# Altium schematic sheet Sheet_1.schdoc
size 432 x 289 mm
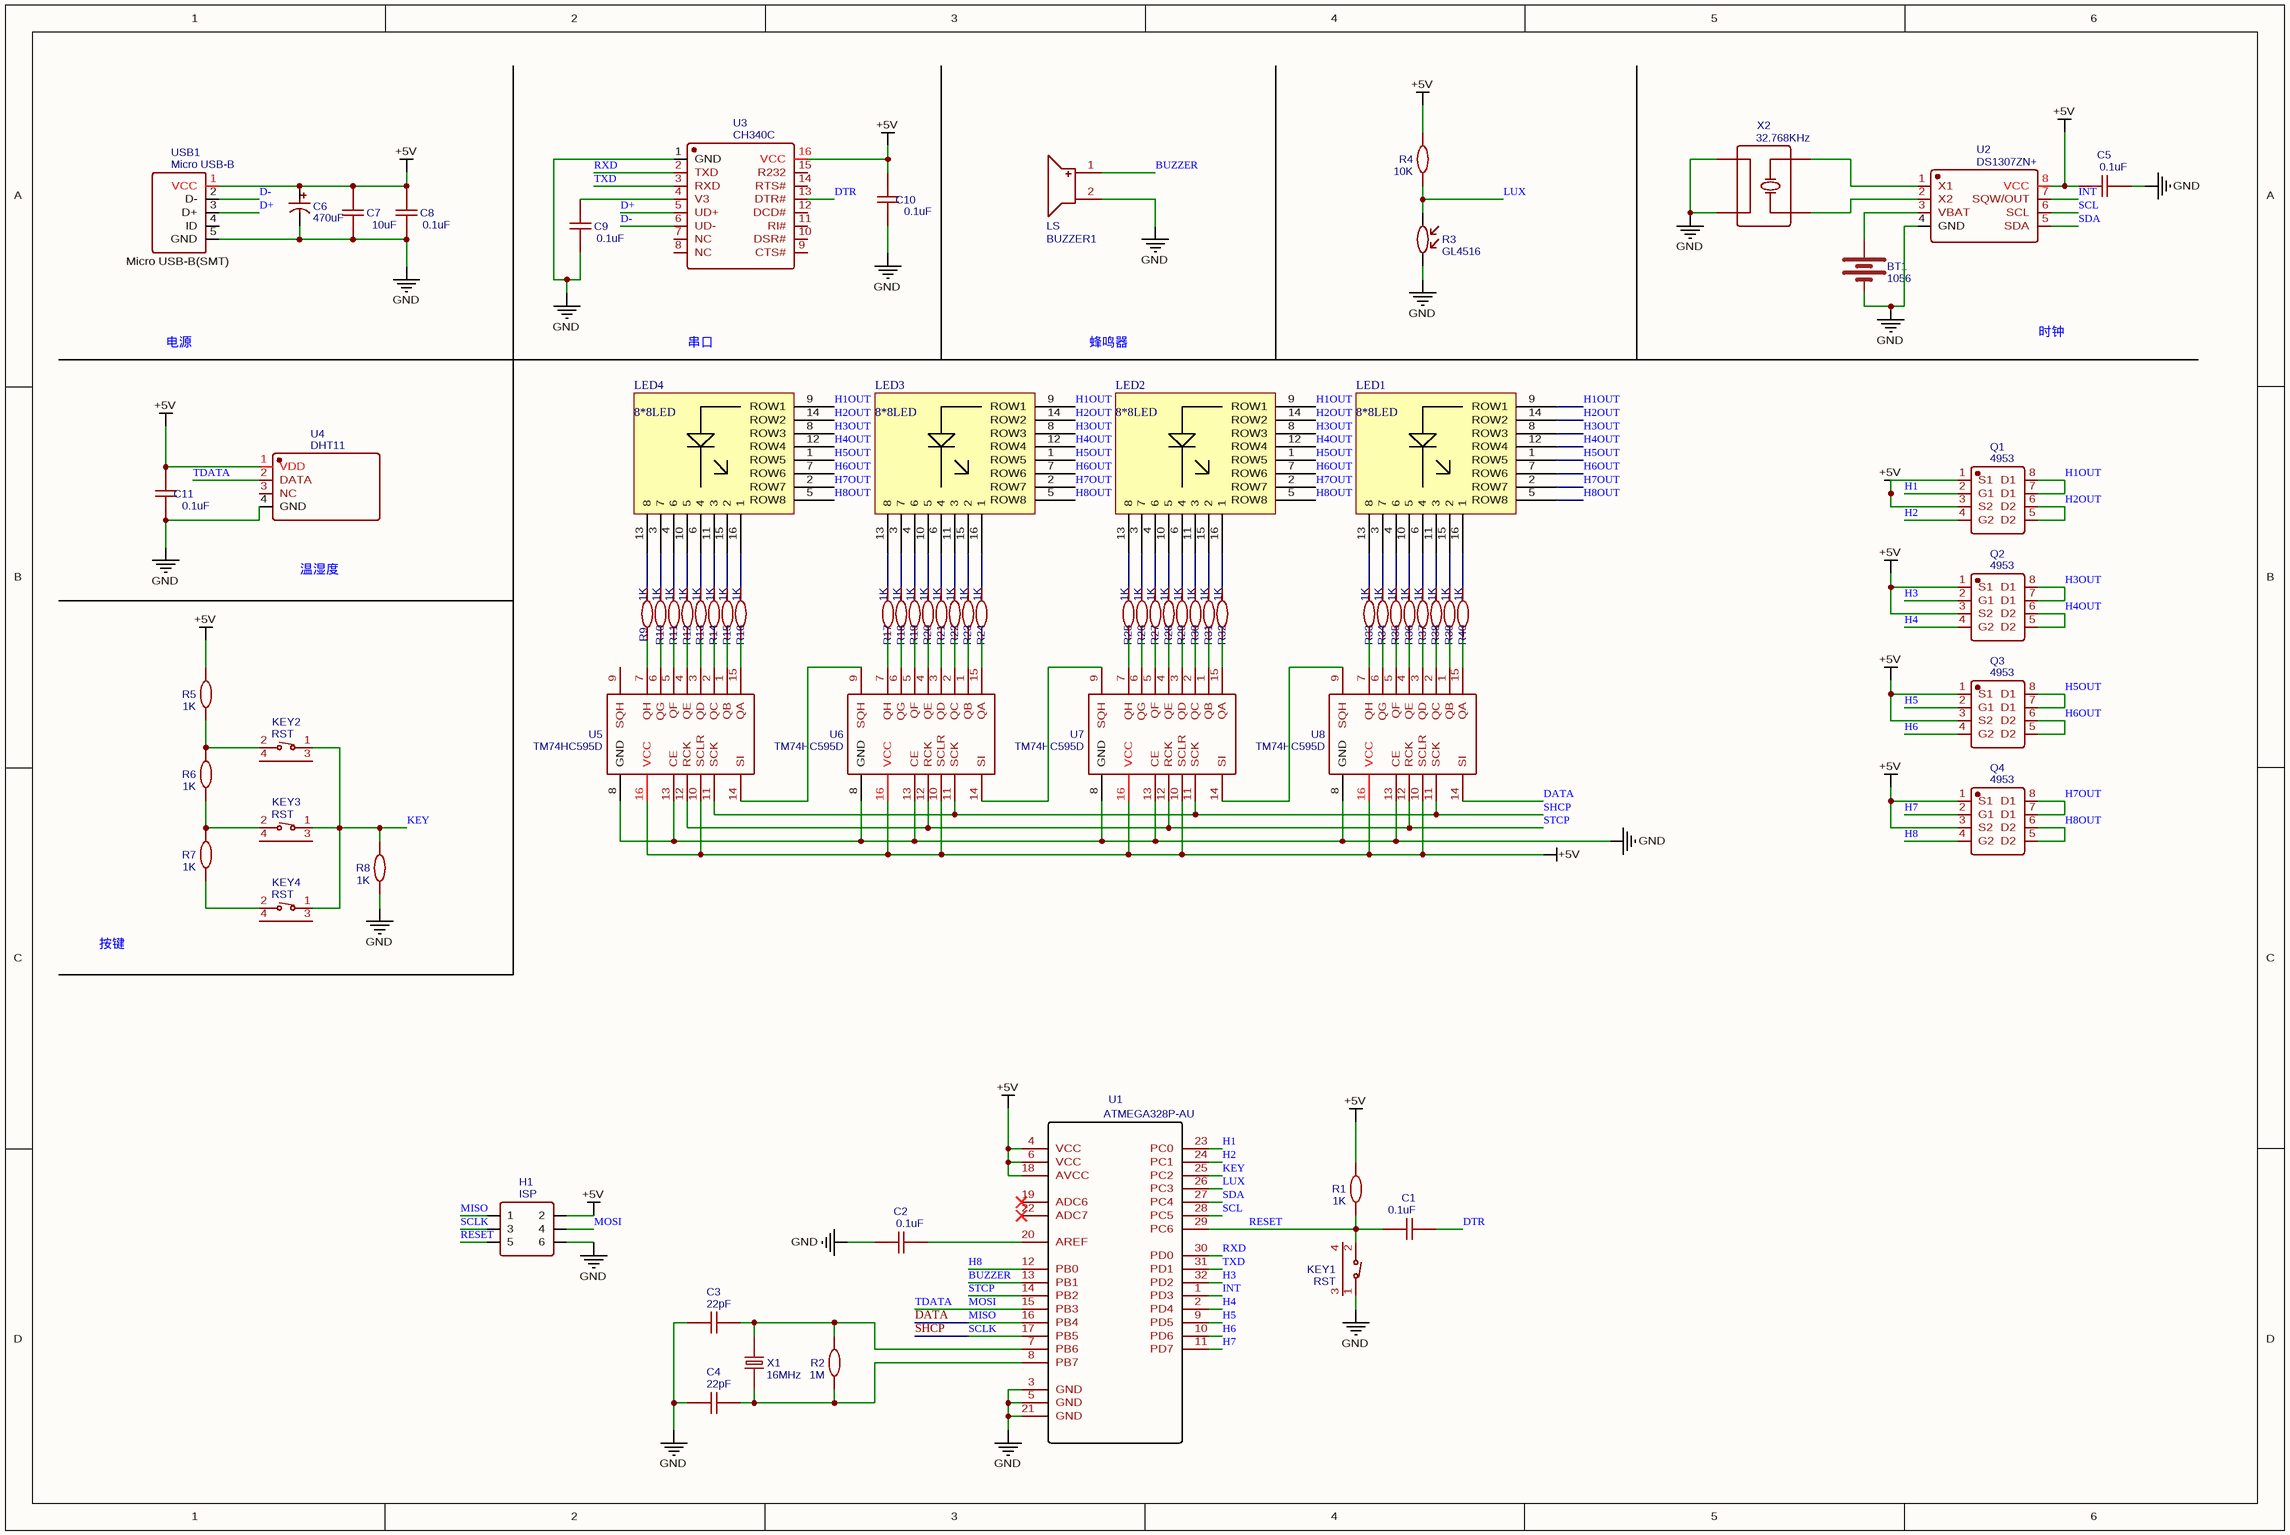
[diagram p0: Sheet_1.schdoc]

## Parts
BT1  1056  [KEYSTONE_1056]
BUZZER1  LS  [BUZZER-R6.0-2P-7.6MM]
C1  0.1uF  [0603]
C2  0.1uF  [0603]
C3  22pF  [0603]
C4  22pF  [0603]
C5  0.1uF  [0603]
C6  470uF  [CASE-D_7343]
C7  10uF  [0603]
C8  0.1uF  [0603]
C9  0.1uF  [0603]
C10  0.1uF  [0603]
C11  0.1uF  [0603]
H1  ISP  [HDR-3X2/2.54]
KEY1  RST  [SW-TH_BBJ6X6X5PH260G]
KEY2  RST  [SW-TH_BBJ6X6X5PH260G]
KEY3  RST  [SW-TH_BBJ6X6X5PH260G]
KEY4  RST  [SW-TH_BBJ6X6X5PH260G]
LED1  8*8LED  [8X8LED]
LED2  8*8LED  [8X8LED]
LED3  8*8LED  [8X8LED]
LED4  8*8LED  [8X8LED]
Q1  4953  [SOP-8]
Q2  4953  [SOP-8]
Q3  4953  [SOP-8]
Q4  4953  [SOP-8]
R1  1K  [0603]
R2  1M  [0603]
R3  GL4516  [RES-TH_L4.30-W3.60-L]
R4  10K  [0603]
R5  1K  [0603]
R6  1K  [0603]
R7  1K  [0603]
R8  1K  [0603]
R9  1K  [0603]
R10  1K  [0603]
R11  1K  [0603]
R12  1K  [0603]
R13  1K  [0603]
R14  1K  [0603]
R15  1K  [0603]
R16  1K  [0603]
R17  1K  [0603]
R18  1K  [0603]
R19  1K  [0603]
R20  1K  [0603]
R21  1K  [0603]
R22  1K  [0603]
R23  1K  [0603]
R24  1K  [0603]
R25  1K  [0603]
R26  1K  [0603]
R27  1K  [0603]
R28  1K  [0603]
R29  1K  [0603]
R30  1K  [0603]
R31  1K  [0603]
R32  1K  [0603]
R33  1K  [0603]
R34  1K  [0603]
R35  1K  [0603]
R36  1K  [0603]
R37  1K  [0603]
R38  1K  [0603]
R39  1K  [0603]
R40  1K  [0603]
U1  ATMEGA328P-AU  [TQFP-32_7X7X08P]
U2  DS1307ZN+  [SOP-8_150MIL]
U3  CH340C  [SOP-16_150MIL]
U4  DHT11  [DHT11]
U5  TM74HC595D  [SOP-16_150MIL]
U6  TM74HC595D  [SOP-16_150MIL]
U7  TM74HC595D  [SOP-16_150MIL]
U8  TM74HC595D  [SOP-16_150MIL]
USB1  Micro USB-B  [MICRO-USB-12]
X1  16MHz  [49S-CRYSTAL]
X2  32.768KHz  [MC-146]

## Nets
+5V: C5.2 C6.1 C7.2 C8.2 C10.2 C11.2 H1.2 Q1.1(S1) Q1.3(S2) Q2.1(S1) Q2.3(S2) Q3.1(S1) Q3.3(S2) Q4.1(S1) Q4.3(S2) R1.2 R4.2 R5.2 U1.4(VCC) U1.6(VCC) U1.18(AVCC) U2.8(VCC) U3.16(VCC) U4.1(VDD) U5.10(SCLR) U5.16(VCC) U6.10(SCLR) U6.16(VCC) U7.10(SCLR) U7.16(VCC) U8.10(SCLR) U8.16(VCC) USB1.1(VCC)
GND: BT1.2(-) BUZZER1.2 C2.1 C3.1 C4.1 C5.1 C6.2 C7.1 C8.1 C9.1 C10.1 C11.1 H1.6 KEY1.1 R3.2 R8.1 U1.3(GND) U1.5(GND) U1.21(GND) U2.4(GND) U3.1(GND) U4.4(GND) U5.8(GND) U5.13(CE) U6.8(GND) U6.13(CE) U7.8(GND) U7.13(CE) U8.8(GND) U8.13(CE) USB1.5(GND) X2.2(GND) X2.3(GND)
BUZZER: BUZZER1.1 U1.13(PB1)
D+: U3.5(UD+) USB1.3(D+)
D-: U3.6(UD-) USB1.2(D-)
DATA: H1.1 U1.16(PB4) U8.14(SI)  [also labelled MISO]
DTR: C1.2 U3.13(DTR#)
H1: Q1.2(G1) U1.23(PC0)
H1OUT: LED1.9(ROW1) LED2.9(ROW1) LED3.9(ROW1) LED4.9(ROW1) Q1.7(D1) Q1.8(D1)
H2: Q1.4(G2) U1.24(PC1)
H2OUT: LED1.14(ROW2) LED2.14(ROW2) LED3.14(ROW2) LED4.14(ROW2) Q1.5(D2) Q1.6(D2)
H3: Q2.2(G1) U1.32(PD2)
H3OUT: LED1.8(ROW3) LED2.8(ROW3) LED3.8(ROW3) LED4.8(ROW3) Q2.7(D1) Q2.8(D1)
H4: Q2.4(G2) U1.2(PD4)
H4OUT: LED1.12(ROW4) LED2.12(ROW4) LED3.12(ROW4) LED4.12(ROW4) Q2.5(D2) Q2.6(D2)
H5: Q3.2(G1) U1.9(PD5)
H5OUT: LED1.1(ROW5) LED2.1(ROW5) LED3.1(ROW5) LED4.1(ROW5) Q3.7(D1) Q3.8(D1)
H6: Q3.4(G2) U1.10(PD6)
H6OUT: LED1.7(ROW6) LED2.7(ROW6) LED3.7(ROW6) LED4.7(ROW6) Q3.5(D2) Q3.6(D2)
H7: Q4.2(G1) U1.11(PD7)
H7OUT: LED1.2(ROW7) LED2.2(ROW7) LED3.2(ROW7) LED4.2(ROW7) Q4.7(D1) Q4.8(D1)
H8: Q4.4(G2) U1.12(PB0)
H8OUT: LED1.5(ROW8) LED2.5(ROW8) LED3.5(ROW8) LED4.5(ROW8) Q4.5(D2) Q4.6(D2)
INT: U1.1(PD3) U2.7(SQW/OUT)
KEY: KEY2.1 KEY3.1 KEY4.1 R8.2 U1.25(PC2)
LUX: R3.1 R4.1 U1.26(PC3)
MOSI: H1.4 U1.15(PB3) U4.2(DATA)  [also labelled TDATA]
RESET: C1.1 H1.5 KEY1.2 R1.1 U1.29(PC6)
RXD: U1.30(PD0) U3.2(TXD)
SCL: U1.28(PC5) U2.6(SCL)
SCLK: H1.3 U1.17(PB5) U5.11(SCK) U6.11(SCK) U7.11(SCK) U8.11(SCK)  [also labelled SHCP]
SDA: U1.27(PC4) U2.5(SDA)
STCP: U1.14(PB2) U5.12(RCK) U6.12(RCK) U7.12(RCK) U8.12(RCK)
TXD: U1.31(PD1) U3.3(RXD)
NetBT1_1: BT1.1(+) U2.3(VBAT)
NetC2_2: C2.2 U1.20(AREF)
NetC3_2: C3.2 R2.2 U1.7(PB6) X1.1
NetC4_2: C4.2 R2.1 U1.8(PB7) X1.2
NetC9_2: C9.2 U3.4(V3)
NetKEY2_2: KEY2.2 R5.1 R6.2
NetKEY3_2: KEY3.2 R6.1 R7.2
NetKEY4_2: KEY4.2 R7.1
NetLED1_3: LED1.3(7) R34.2
NetLED1_4: LED1.4(6) R35.2
NetLED1_6: LED1.6(4) R37.2
NetLED1_10: LED1.10(5) R36.2
NetLED1_11: LED1.11(3) R38.2
NetLED1_13: LED1.13(8) R33.2
NetLED1_15: LED1.15(2) R39.2
NetLED1_16: LED1.16(1) R40.2
NetLED2_3: LED2.3(7) R26.2
NetLED2_4: LED2.4(6) R27.2
NetLED2_6: LED2.6(4) R29.2
NetLED2_10: LED2.10(5) R28.2
NetLED2_11: LED2.11(3) R30.2
NetLED2_13: LED2.13(8) R25.2
NetLED2_15: LED2.15(2) R31.2
NetLED2_16: LED2.16(1) R32.2
NetLED3_3: LED3.3(7) R18.2
NetLED3_4: LED3.4(6) R19.2
NetLED3_6: LED3.6(4) R21.2
NetLED3_10: LED3.10(5) R20.2
NetLED3_11: LED3.11(3) R22.2
NetLED3_13: LED3.13(8) R17.2
NetLED3_15: LED3.15(2) R23.2
NetLED3_16: LED3.16(1) R24.2
NetLED4_3: LED4.3(7) R10.2
NetLED4_4: LED4.4(6) R11.2
NetLED4_6: LED4.6(4) R13.2
NetLED4_10: LED4.10(5) R12.2
NetLED4_11: LED4.11(3) R14.2
NetLED4_13: LED4.13(8) R9.2
NetLED4_15: LED4.15(2) R15.2
NetLED4_16: LED4.16(1) R16.2
NetR9_1: R9.1 U5.7(QH)
NetR10_1: R10.1 U5.6(QG)
NetR11_1: R11.1 U5.5(QF)
NetR12_1: R12.1 U5.4(QE)
NetR13_1: R13.1 U5.3(QD)
NetR14_1: R14.1 U5.2(QC)
NetR15_1: R15.1 U5.1(QB)
NetR16_1: R16.1 U5.15(QA)
NetR17_1: R17.1 U6.7(QH)
NetR18_1: R18.1 U6.6(QG)
NetR19_1: R19.1 U6.5(QF)
NetR20_1: R20.1 U6.4(QE)
NetR21_1: R21.1 U6.3(QD)
NetR22_1: R22.1 U6.2(QC)
NetR23_1: R23.1 U6.1(QB)
NetR24_1: R24.1 U6.15(QA)
NetR25_1: R25.1 U7.7(QH)
NetR26_1: R26.1 U7.6(QG)
NetR27_1: R27.1 U7.5(QF)
NetR28_1: R28.1 U7.4(QE)
NetR29_1: R29.1 U7.3(QD)
NetR30_1: R30.1 U7.2(QC)
NetR31_1: R31.1 U7.1(QB)
NetR32_1: R32.1 U7.15(QA)
NetR33_1: R33.1 U8.7(QH)
NetR34_1: R34.1 U8.6(QG)
NetR35_1: R35.1 U8.5(QF)
NetR36_1: R36.1 U8.4(QE)
NetR37_1: R37.1 U8.3(QD)
NetR38_1: R38.1 U8.2(QC)
NetR39_1: R39.1 U8.1(QB)
NetR40_1: R40.1 U8.15(QA)
NetU2_1: U2.1(X1) X2.1(OSC1)
NetU2_2: U2.2(X2) X2.4(OSC2)
NetU5_14: U5.14(SI) U6.9(SQH)
NetU6_14: U6.14(SI) U7.9(SQH)
NetU7_14: U7.14(SI) U8.9(SQH)

Not connected (* = marked no-connect by the designer): KEY1 3 4; KEY2 3 4; KEY3 3 4; KEY4 3 4; U1 19(ADC6)* 22(ADC7)*; U3 7(NC) 8(NC) 9(CTS#) 10(DSR#) 11(RI#) 12(DCD#) 14(RTS#) 15(R232); U4 3(NC); U5 9(SQH); USB1 4(ID)

## Notes on the sheet
- 电源
- 串口
- 蜂鸣器
- 时钟
- 温湿度
- 按键
- (in symbol Micro USB-B) Micro USB-B(SMT)

## Library data of the parts
BT1 = 1056: BOM_Manufacturer: Keystone; Contributor: LCSC; BOM_Supplier: LCSC; BOM_Supplier Part: C238067; BOM_Manufacturer Part: 1056; spicePre: B
BUZZER1 = LS: BOM_Manufacturer: INGHAi; BOM_Manufacturer Part: GMD12095YB-24V2400; Contributor: LCSC; BOM_Supplier: LCSC; BOM_Supplier Part: C252943; spicePre: B
C1 C2 C5 C8-C11 = 0.1uF: BOM_Manufacturer: TORCH; BOM_Manufacturer Part: CT41-0603-2F4-50V-0.1uF-M(N); nameAlias: Capacitance; Contributor: LCSC; BOM_Supplier: LCSC; BOM_Supplier Part: C138344; spicePre: C; spiceSymbolName: CT41-0603-2F4-50V-0.1UF-M(N)
C3 C4 = 22pF: BOM_Manufacturer: FH; BOM_Manufacturer Part: 0603CG220J500NT; nameAlias: Capacitance; BOM_Supplier: LCSC; BOM_Supplier Part: C91701; spicePre: C; spiceSymbolName: 0603CG220J500NT
C6 = 470uF: BOM_Manufacturer: KEMET; BOM_Manufacturer Part: T520D477M006ATE025; nameAlias: Capacitance; Contributor: LCSC; SMT Type: Extend; BOM_Supplier: LCSC; BOM_Supplier Part: C156460; BOM_LCSC Assembly: Yes; spicePre: C; spiceSymbolName: T520D477M006ATE025
C7 = 10uF: BOM_Manufacturer: TORCH; BOM_Manufacturer Part: CT41-0603-2F4-50V-0.1uF-M(N); nameAlias: Capacitance; Contributor: LCSC; BOM_Supplier: LCSC; BOM_Supplier Part: C138344; spicePre: C; spiceSymbolName: CT41-0603-2F4-50V-0.1UF-M(N)
H1 = ISP: BOM_Manufacturer: CONNFLY; BOM_Manufacturer Part: DS1023-2*3SF11; Contributor: LCSC; BOM_Supplier: LCSC; BOM_Supplier Part: C92272; spicePre: H
KEY1-KEY4 = RST: BOM_Manufacturer: BBJ; BOM_Manufacturer Part: Switch,6*6*5Plastic head,260G, 0.25mm,Side foot; BOM_Supplier Part: C71832; BOM_Supplier: LCSC; spicePre: K
Q1-Q4 = 4953: BOM_Manufacturer: Hottech; Contributor: LCSC; SMT Type: Extend; BOM_Supplier: LCSC; BOM_Manufacturer Part: 4953; BOM_Supplier Part: C181099; BOM_LCSC Assembly: Yes; spicePre: Q
R1 R5-R40 = 1K: BOM_Manufacturer: Ever Ohms Tech; BOM_Manufacturer Part: TR0603B1KP0525; nameAlias: Resistance (Ohms); Contributor: LCSC; BOM_Supplier: LCSC; BOM_Supplier Part: C188364; spicePre: R; spiceSymbolName: TR0603B1KP0525
R2 = 1M: BOM_Manufacturer: Ever Ohms Tech; BOM_Manufacturer Part: TR0603B1KP0525; nameAlias: Resistance (Ohms); Contributor: LCSC; BOM_Supplier: LCSC; BOM_Supplier Part: C188364; spicePre: R; spiceSymbolName: TR0603B1KP0525
R3 = GL4516: BOM_Manufacturer: Senba; nameAlias: Value; BOM_Supplier: LCSC; BOM_Manufacturer Part: GL4516; BOM_Supplier Part: C125632; spicePre: R; spiceSymbolName: GL4516
R4 = 10K: BOM_Manufacturer: Ever Ohms Tech; BOM_Manufacturer Part: TR0603B1KP0525; nameAlias: Resistance (Ohms); Contributor: LCSC; BOM_Supplier: LCSC; BOM_Supplier Part: C188364; spicePre: R; spiceSymbolName: TR0603B1KP0525
U1 = ATMEGA328P-AU: BOM_Manufacturer: MICROCHIP; SMT Type: Extend; BOM_Supplier: LCSC; BOM_Manufacturer Part: ATMEGA328P-AU; image: //image.lceda.cn/szlcsc/C14877.jpg; BOM_Supplier Part: C14877; BOM_LCSC Assembly: Yes; spicePre: U
U2 = DS1307ZN+: BOM_Manufacturer: MAXIM; SMT Type: Extend; spicePre: X; BOM_Supplier: LCSC; BOM_Manufacturer Part: DS1307ZN+; image: //image.lceda.cn/szlcsc/C26858.jpg; BOM_Supplier Part: C26858; BOM_LCSC Assembly: Yes
U3 = CH340C: BOM_Manufacturer: WCH; BOM_Supplier: LCSC; BOM_Manufacturer Part: CH340C; BOM_Supplier Part: C84681; spicePre: U
U4 = DHT11: BOM_Manufacturer: Aosong (Guangzhou) Elec; Contributor: LCSC; BOM_Supplier: LCSC; BOM_Supplier Part: C117051; BOM_Manufacturer Part: DHT11; spicePre: U
U5-U8 = TM74HC595D: BOM_Manufacturer: TM; SMT Type: Extend; BOM_Supplier: LCSC; BOM_Manufacturer Part: TM74HC595D; BOM_Supplier Part: C79097; BOM_LCSC Assembly: Yes; spicePre: U
USB1 = Micro USB-B: BOM_Manufacturer: ValuePro; BOM_Manufacturer Part: Micro USB-B 5P_C40942; BOM_Supplier: LCSC; image: //image.lceda.cn/szlcsc/C40942.jpg; BOM_Supplier Part: C40942; spicePre: U
X1 = 16MHz: BOM_Manufacturer: TAITIEN Elec; BOM_Manufacturer Part: XIHCELNANF-16MHZ; nameAlias: Frequency; Contributor: LCSC; BOM_Supplier: LCSC; BOM_Supplier Part: C295075; spicePre: X; spiceSymbolName: XIHCELNANF-16MHZ
X2 = 32.768KHz: BOM_Manufacturer: EPSON; BOM_Manufacturer Part: MC-14632.768kHz7.0pF20PPM; nameAlias: Frequency; Contributor: LCSC; BOM_Supplier: LCSC; BOM_Supplier Part: C94977; spicePre: X; spiceSymbolName: MC-14632.768kHz7.0pF20PPM